# Altium schematic sheet DataMergeBoardTop.SchDoc
size A
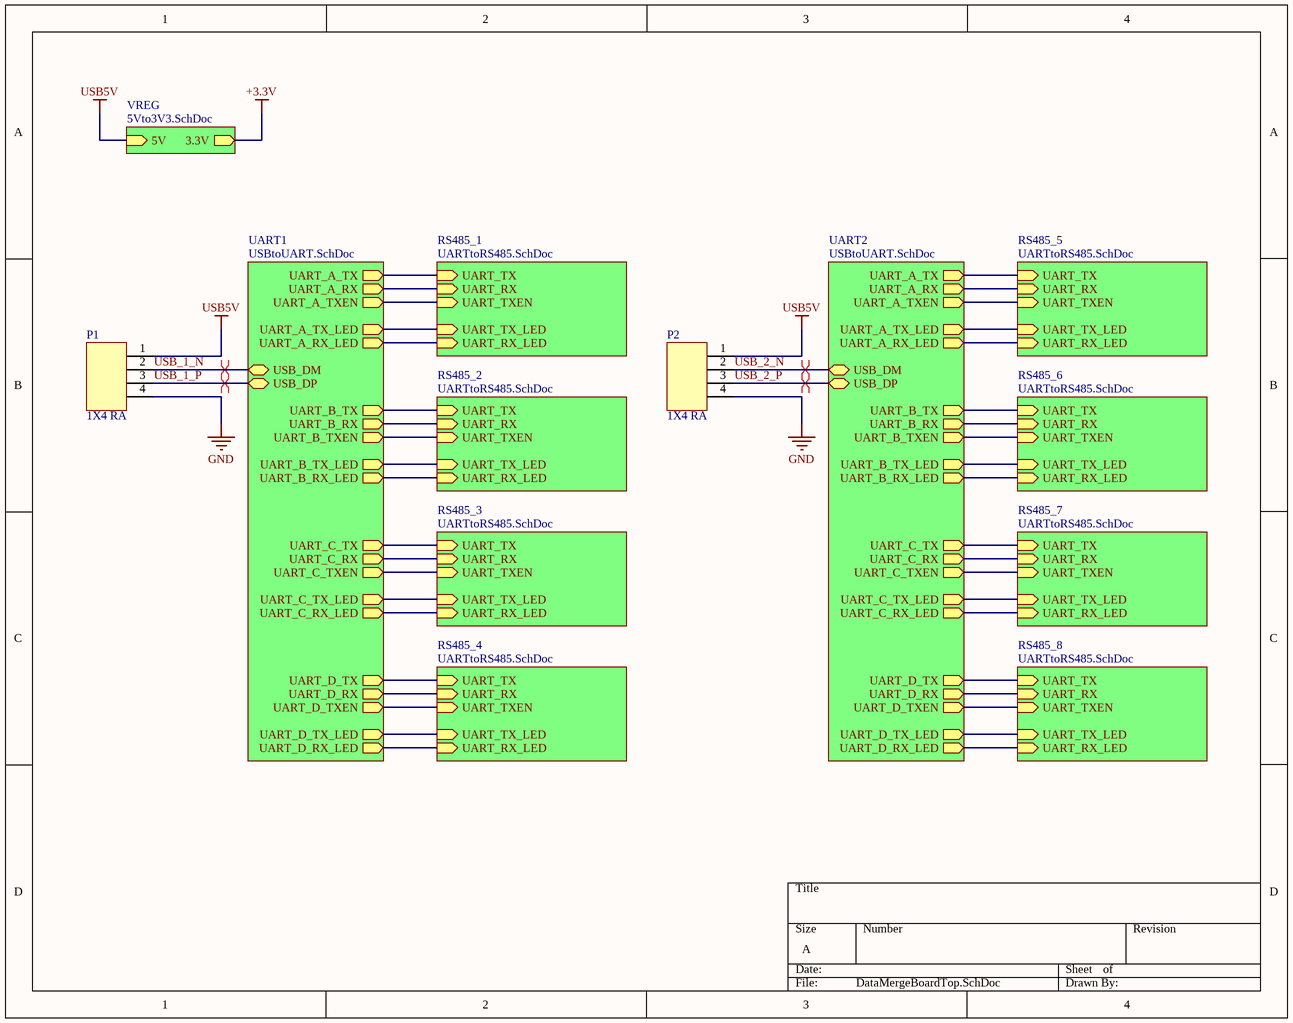
[diagram p0: DataMergeBoardTop.SchDoc]

## Parts
P1  1X4 RA  [MOLEX-HDR-1X4-SHERLOCK-RA]
P2  1X4 RA  [MOLEX-HDR-1X4-SHERLOCK-RA]

## Sub-sheets
RS485_1 = UARTtoRS485.SchDoc: UART_TX (in), UART_RX (in), UART_TXEN (in), UART_RX_LED (in), UART_TX_LED (in)
RS485_2 = UARTtoRS485.SchDoc: UART_TX (in), UART_RX (in), UART_TXEN (in), UART_RX_LED (in), UART_TX_LED (in)
RS485_3 = UARTtoRS485.SchDoc: UART_TX (in), UART_RX (in), UART_TXEN (in), UART_RX_LED (in), UART_TX_LED (in)
RS485_4 = UARTtoRS485.SchDoc: UART_TX (in), UART_RX (in), UART_TXEN (in), UART_RX_LED (in), UART_TX_LED (in)
RS485_5 = UARTtoRS485.SchDoc: UART_TX (in), UART_RX (in), UART_TXEN (in), UART_RX_LED (in), UART_TX_LED (in)
RS485_6 = UARTtoRS485.SchDoc: UART_TX (in), UART_RX (in), UART_TXEN (in), UART_RX_LED (in), UART_TX_LED (in)
RS485_7 = UARTtoRS485.SchDoc: UART_TX (in), UART_RX (in), UART_TXEN (in), UART_RX_LED (in), UART_TX_LED (in)
RS485_8 = UARTtoRS485.SchDoc: UART_TX (in), UART_RX (in), UART_TXEN (in), UART_RX_LED (in), UART_TX_LED (in)
UART1 = USBtoUART.SchDoc: UART_A_TX (out), UART_A_RX (out), UART_A_TXEN (out), UART_B_RX (out), UART_B_TX (out), UART_B_TXEN (out), UART_C_RX (out), UART_C_TX (out), UART_C_TXEN (out), UART_D_RX (out), UART_D_TX (out), UART_D_TXEN (out), USB_DP (bidir), USB_DM (bidir), UART_A_TX_LED (out), UART_A_RX_LED (out), UART_B_TX_LED (out), UART_C_TX_LED (out), UART_D_TX_LED (out), UART_B_RX_LED (out), UART_C_RX_LED (out), UART_D_RX_LED (out)
UART2 = USBtoUART.SchDoc: UART_A_TX (out), UART_A_RX (out), UART_A_TXEN (out), UART_B_RX (out), UART_B_TX (out), UART_B_TXEN (out), UART_C_RX (out), UART_C_TX (out), UART_C_TXEN (out), UART_D_RX (out), UART_D_TX (out), UART_D_TXEN (out), USB_DM (bidir), USB_DP (bidir), UART_A_TX_LED (out), UART_A_RX_LED (out), UART_B_TX_LED (out), UART_C_TX_LED (out), UART_D_TX_LED (out), UART_B_RX_LED (out), UART_C_RX_LED (out), UART_D_RX_LED (out)
VREG = 5Vto3V3.SchDoc: 5V (in), 3.3V (out)

## Nets
+3.3V: sheet VREG/3.3V
GND: P1.4 P2.4
USB5V: P1.1 P2.1 ; sheet VREG/5V
USB_1_N: P1.2 ; sheet UART1/USB_DM
USB_1_P: P1.3 ; sheet UART1/USB_DP
USB_2_N: P2.2 ; sheet UART2/USB_DM
USB_2_P: P2.3 ; sheet UART2/USB_DP
(unnamed): sheet RS485_1/UART_TX, sheet UART1/UART_A_TX
(unnamed): sheet RS485_1/UART_RX, sheet UART1/UART_A_RX
(unnamed): sheet RS485_1/UART_TXEN, sheet UART1/UART_A_TXEN
(unnamed): sheet RS485_1/UART_RX_LED, sheet UART1/UART_A_RX_LED
(unnamed): sheet RS485_1/UART_TX_LED, sheet UART1/UART_A_TX_LED
(unnamed): sheet UART1/UART_B_RX, sheet RS485_2/UART_RX
(unnamed): sheet UART1/UART_B_TX, sheet RS485_2/UART_TX
(unnamed): sheet UART1/UART_B_TXEN, sheet RS485_2/UART_TXEN
(unnamed): sheet UART1/UART_C_RX, sheet RS485_3/UART_RX
(unnamed): sheet UART1/UART_C_TX, sheet RS485_3/UART_TX
(unnamed): sheet UART1/UART_C_TXEN, sheet RS485_3/UART_TXEN
(unnamed): sheet UART1/UART_D_RX, sheet RS485_4/UART_RX
(unnamed): sheet UART1/UART_D_TX, sheet RS485_4/UART_TX
(unnamed): sheet UART1/UART_D_TXEN, sheet RS485_4/UART_TXEN
(unnamed): sheet UART1/UART_B_TX_LED, sheet RS485_2/UART_TX_LED
(unnamed): sheet UART1/UART_C_TX_LED, sheet RS485_3/UART_TX_LED
(unnamed): sheet UART1/UART_D_TX_LED, sheet RS485_4/UART_TX_LED
(unnamed): sheet UART1/UART_B_RX_LED, sheet RS485_2/UART_RX_LED
(unnamed): sheet UART1/UART_C_RX_LED, sheet RS485_3/UART_RX_LED
(unnamed): sheet UART1/UART_D_RX_LED, sheet RS485_4/UART_RX_LED
(unnamed): sheet RS485_5/UART_TX, sheet UART2/UART_A_TX
(unnamed): sheet RS485_5/UART_RX, sheet UART2/UART_A_RX
(unnamed): sheet RS485_5/UART_TXEN, sheet UART2/UART_A_TXEN
(unnamed): sheet RS485_5/UART_RX_LED, sheet UART2/UART_A_RX_LED
(unnamed): sheet RS485_5/UART_TX_LED, sheet UART2/UART_A_TX_LED
(unnamed): sheet UART2/UART_B_RX, sheet RS485_6/UART_RX
(unnamed): sheet UART2/UART_B_TX, sheet RS485_6/UART_TX
(unnamed): sheet UART2/UART_B_TXEN, sheet RS485_6/UART_TXEN
(unnamed): sheet UART2/UART_C_RX, sheet RS485_7/UART_RX
(unnamed): sheet UART2/UART_C_TX, sheet RS485_7/UART_TX
(unnamed): sheet UART2/UART_C_TXEN, sheet RS485_7/UART_TXEN
(unnamed): sheet UART2/UART_D_RX, sheet RS485_8/UART_RX
(unnamed): sheet UART2/UART_D_TX, sheet RS485_8/UART_TX
(unnamed): sheet UART2/UART_D_TXEN, sheet RS485_8/UART_TXEN
(unnamed): sheet UART2/UART_B_TX_LED, sheet RS485_6/UART_TX_LED
(unnamed): sheet UART2/UART_C_TX_LED, sheet RS485_7/UART_TX_LED
(unnamed): sheet UART2/UART_D_TX_LED, sheet RS485_8/UART_TX_LED
(unnamed): sheet UART2/UART_B_RX_LED, sheet RS485_6/UART_RX_LED
(unnamed): sheet UART2/UART_C_RX_LED, sheet RS485_7/UART_RX_LED
(unnamed): sheet UART2/UART_D_RX_LED, sheet RS485_8/UART_RX_LED

## Layout directives
differential pair: USB_1_N, USB_1_P, USB_2_N, USB_2_P

## Library data of the parts
P1 P2 = MOLEX-HDR-1x4-SHERLOCK_RA: CONN HEADER 4POS 2MM R/A TIN; Supplier Part Number 1: WM18933-ND; Supplier 1: Digi-Key